# Altium schematic sheet main.SCHDOC
size B
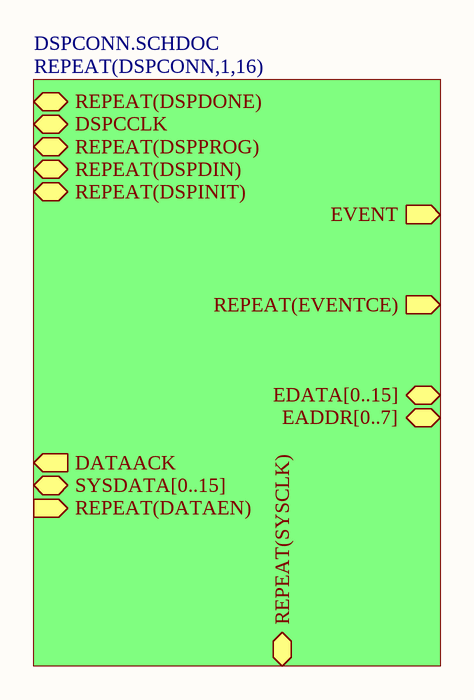
[diagram p0: main.SCHDOC]

## Sub-sheets
REPEAT(DSPCONN,1,16) = DSPCONN.SCHDOC: REPEAT(DSPDONE) (bidir), DSPCCLK (bidir), REPEAT(DSPPROG) (bidir), REPEAT(DSPDIN) (bidir), REPEAT(DSPINIT) (bidir), REPEAT(SYSCLK) (bidir), SYSDATA[0..15] (bidir), EDATA[0..15] (bidir), REPEAT(DATAEN) (in), DATAACK (out), EVENT (out), REPEAT(EVENTCE) (out), EADDR[0..7] (bidir)